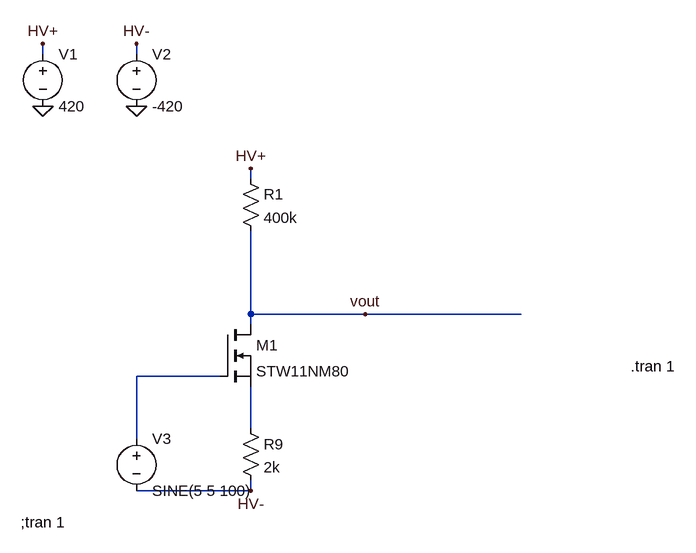
[diagram p0: schematic common source.asc]
common source.asc, the LTspice schematic file:
Version 4
SHEET 1 992 932
WIRE -112 -208 -112 -224
WIRE 32 -208 32 -224
WIRE 208 -16 208 -32
WIRE 208 192 208 64
WIRE 384 192 208 192
WIRE 624 192 384 192
WIRE 208 208 208 192
WIRE 160 288 32 288
WIRE 208 368 208 304
WIRE 32 384 32 288
WIRE 208 464 208 448
WIRE 208 464 32 464
FLAG -112 -128 0
FLAG 32 -128 0
FLAG -112 -224 HV+
FLAG 32 -224 HV-
FLAG 208 -32 HV+
FLAG 384 192 vout
FLAG 208 464 HV-
SYMBOL nmos 160 208 R0
SYMATTR InstName M1
SYMATTR Value STW11NM80
SYMBOL voltage -112 -224 R0
WINDOW 123 0 0 Left 2
WINDOW 39 0 0 Left 2
SYMATTR InstName V1
SYMATTR Value 420
SYMBOL voltage 32 -224 R0
WINDOW 123 0 0 Left 2
WINDOW 39 0 0 Left 2
SYMATTR InstName V2
SYMATTR Value -420
SYMBOL voltage 32 368 R0
WINDOW 123 24 44 Left 2
WINDOW 39 0 0 Left 2
SYMATTR InstName V3
SYMATTR Value SINE(5 5 100)
SYMBOL res 192 -32 R0
SYMATTR InstName R1
SYMATTR Value 400k
SYMBOL res 192 352 R0
SYMATTR InstName R9
SYMATTR Value 2k
TEXT 792 272 Left 2 !.tran 1
TEXT -146 512 Left 2 !;tran 1

The netlist it stands for:
* common source.asc
M1 vout N001 N002 N002 STW11NM80
V1 HV+ 0 420
V2 HV- 0 -420
V3 N001 HV- SINE(5 5 100)
R1 HV+ vout 400k
R9 N002 HV- 2k
.model NMOS NMOS
.model PMOS PMOS
.lib standard.mos
.tran 1
;tran 1
.backanno
.end